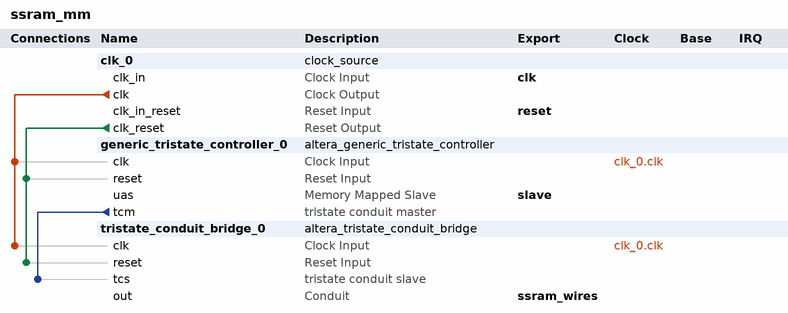
[diagram p0: system contents]
# Platform Designer (Qsys) system ssram_mm, Cyclone IV GX EP4CGX150DF31C7
# Parameters at their usual value, and those the tool derives, are not listed.
package require -exact qsys 15.0
create_system ssram_mm
set_project_property DEVICE_FAMILY {Cyclone IV GX}
set_project_property DEVICE EP4CGX150DF31C7

add_instance clk_0 clock_source 15.0
set_instance_parameter_value clk_0 clockFrequency 50000000
set_instance_parameter_value clk_0 clockFrequencyKnown false

add_instance generic_tristate_controller_0 altera_generic_tristate_controller 15.0
set_instance_parameter_value generic_tristate_controller_0 ACTIVE_LOW_BEGINTRANSFER 1
set_instance_parameter_value generic_tristate_controller_0 ACTIVE_LOW_BYTEENABLE 1
set_instance_parameter_value generic_tristate_controller_0 ACTIVE_LOW_OUTPUTENABLE 1
set_instance_parameter_value generic_tristate_controller_0 ACTIVE_LOW_READ 0
set_instance_parameter_value generic_tristate_controller_0 ACTIVE_LOW_RESET_OUTPUT 1
set_instance_parameter_value generic_tristate_controller_0 CHIPSELECT_THROUGH_READLATENCY 1
set_instance_parameter_value generic_tristate_controller_0 INTERFACE_ASSIGNMENT_KEYS embeddedsw.configuration.isMemoryDevice
set_instance_parameter_value generic_tristate_controller_0 INTERFACE_ASSIGNMENT_VALUES 1
set_instance_parameter_value generic_tristate_controller_0 MODULE_ASSIGNMENT_KEYS embeddedsw.configuration.hwClassnameDriverSupportList,embeddedsw.CMacro.SRAM_MEMORY_SIZE,embeddedsw.CMacro.SRAM_MEMORY_UNITS,embeddedsw.CMacro.SSRAM_DATA_WIDTH,embeddedsw.CMacro.SSRAM_READ_LATENCY,embeddedsw.memoryInfo.MEM_INIT_DATA_WIDTH,embeddedsw.memoryInfo.HAS_BYTE_LANE,embeddedsw.memoryInfo.GENERATE_DAT_SYM,embeddedsw.memoryInfo.DAT_SYM_INSTALL_DIR
set_instance_parameter_value generic_tristate_controller_0 MODULE_ASSIGNMENT_VALUES altera_avalon_lan91c111:altera_avalon_cfi_flash,2,524288,32,2,32,1,1,SIM_DIR
set_instance_parameter_value generic_tristate_controller_0 TCM_ADDRESS_W 20
set_instance_parameter_value generic_tristate_controller_0 TCM_BYTEENABLE_W 4
set_instance_parameter_value generic_tristate_controller_0 TCM_DATA_HOLD 0
set_instance_parameter_value generic_tristate_controller_0 TCM_DATA_W 32
set_instance_parameter_value generic_tristate_controller_0 TCM_MAX_PENDING_READ_TRANSACTIONS 5
set_instance_parameter_value generic_tristate_controller_0 TCM_READLATENCY 4
set_instance_parameter_value generic_tristate_controller_0 TCM_READ_WAIT 0
set_instance_parameter_value generic_tristate_controller_0 TCM_SETUP_WAIT 0
set_instance_parameter_value generic_tristate_controller_0 TCM_SYMBOLS_PER_WORD 4
set_instance_parameter_value generic_tristate_controller_0 TCM_TIMING_UNITS 1
set_instance_parameter_value generic_tristate_controller_0 TCM_TURNAROUND_TIME 2
set_instance_parameter_value generic_tristate_controller_0 TCM_WRITE_WAIT 0
set_instance_parameter_value generic_tristate_controller_0 USE_BEGINTRANSFER 1
set_instance_parameter_value generic_tristate_controller_0 USE_BYTEENABLE 1
set_instance_parameter_value generic_tristate_controller_0 USE_OUTPUTENABLE 1
set_instance_parameter_value generic_tristate_controller_0 USE_READ 0
set_instance_parameter_value generic_tristate_controller_0 USE_RESET_OUTPUT 1

add_instance tristate_conduit_bridge_0 altera_tristate_conduit_bridge 15.0

# connections
add_connection clk_0.clk generic_tristate_controller_0.clk clock
add_connection clk_0.clk tristate_conduit_bridge_0.clk clock
add_connection clk_0.clk_reset generic_tristate_controller_0.reset reset
add_connection clk_0.clk_reset tristate_conduit_bridge_0.reset reset
add_connection generic_tristate_controller_0.tcm tristate_conduit_bridge_0.tcs tristate_conduit

# exported interfaces
add_interface clk clock sink
set_interface_property clk EXPORT_OF clk_0.clk_in
add_interface reset reset sink
set_interface_property reset EXPORT_OF clk_0.clk_in_reset
add_interface slave avalon slave
set_interface_property slave EXPORT_OF generic_tristate_controller_0.uas
add_interface ssram_wires conduit end
set_interface_property ssram_wires EXPORT_OF tristate_conduit_bridge_0.out

set_interconnect_requirement {$system} qsys_mm.clockCrossingAdapter HANDSHAKE
set_interconnect_requirement {$system} qsys_mm.enableEccProtection FALSE
set_interconnect_requirement {$system} qsys_mm.insertDefaultSlave FALSE
set_interconnect_requirement {$system} qsys_mm.maxAdditionalLatency 1

save_system ssram_mm.qsys
